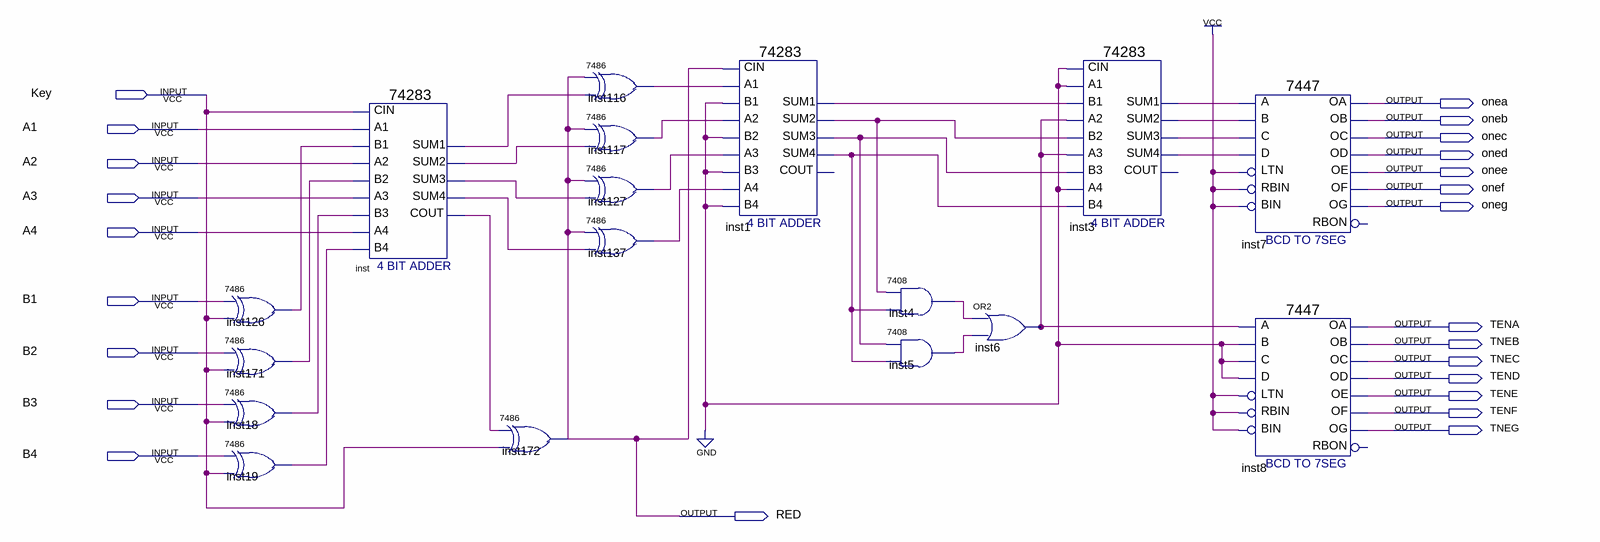
[diagram p0: schematic sheet]
// Quartus schematic Block1.bdf as structural Verilog: 17 symbols, 24 pins
module Block1 (
  input  Key,
  input  A1,
  input  A2,
  input  A3,
  input  A4,
  input  B1,
  input  B2,
  input  B3,
  input  B4,
  output onea,
  output oneb,
  output onec,
  output oned,
  output onee,
  output onef,
  output oneg,
  output TENA,
  output TNEB,
  output TNEC,
  output TEND,
  output TENE,
  output TENF,
  output TNEG,
  output RED
);

  wire inst1_sum1, inst1_sum2, inst1_sum3, inst1_sum4, inst3_sum1, inst3_sum2, inst3_sum3, inst3_sum4,
       inst4_1, inst5_1, inst6_out, inst18_1, inst19_1, inst116_1, inst117_1, inst126_1, inst127_1,
       inst137_1, inst171_1, inst_cout, inst_sum1, inst_sum2, inst_sum3, inst_sum4;

  \7486  inst126 (.\2 (B1), .\3 (Key), .\1 (inst126_1));
  \7486  inst171 (.\2 (B2), .\3 (Key), .\1 (inst171_1));
  \7486  inst18 (.\2 (B3), .\3 (Key), .\1 (inst18_1));
  \7486  inst19 (.\2 (B4), .\3 (Key), .\1 (inst19_1));
  \74283  inst (
    .CIN(Key), .A1(A1), .A2(A2), .B2(inst171_1), .A3(A3), .A4(A4), .B4(inst19_1), .B1(inst126_1),
    .B3(inst18_1), .SUM4(inst_sum4), .COUT(inst_cout), .SUM1(inst_sum1), .SUM2(inst_sum2), .SUM3(inst_sum3));
  \7486  inst172 (.\2 (inst_cout), .\3 (Key), .\1 (RED));
  \7486  inst116 (.\2 (RED), .\3 (inst_sum1), .\1 (inst116_1));
  \7486  inst117 (.\2 (RED), .\3 (inst_sum2), .\1 (inst117_1));
  \7486  inst127 (.\2 (RED), .\3 (inst_sum3), .\1 (inst127_1));
  \7486  inst137 (.\2 (RED), .\3 (inst_sum4), .\1 (inst137_1));
  \74283  inst1 (
    .CIN(RED), .A1(inst116_1), .A2(inst117_1), .B2(1'b0), .A3(inst127_1), .A4(inst137_1), .B4(1'b0),
    .B1(1'b0), .B3(1'b0), .SUM4(inst1_sum4), .SUM1(inst1_sum1), .SUM2(inst1_sum2), .SUM3(inst1_sum3));  // open: COUT
  \7408  inst4 (.\3 (inst1_sum4), .\2 (inst1_sum2), .\1 (inst4_1));
  \7408  inst5 (.\3 (inst1_sum4), .\2 (inst1_sum3), .\1 (inst5_1));
  or inst6 (inst6_out, inst4_1, inst5_1);
  \74283  inst3 (
    .CIN(1'b0), .A1(1'b0), .A2(inst6_out), .B2(inst1_sum2), .A3(inst6_out), .A4(1'b0), .B4(inst1_sum4),
    .B1(inst1_sum1), .B3(inst1_sum3), .SUM4(inst3_sum4), .SUM1(inst3_sum1), .SUM2(inst3_sum2),
    .SUM3(inst3_sum3));  // open: COUT
  \7447  inst7 (
    .LTN(1'b1), .B(inst3_sum2), .C(inst3_sum3), .D(inst3_sum4), .RBIN(1'b1), .BIN(1'b1), .A(inst3_sum1),
    .OB(oneb), .OC(onec), .OE(onee), .OD(oned), .OF(onef), .OG(oneg), .OA(onea));  // open: RBON
  \7447  inst8 (
    .LTN(1'b1), .B(1'b0), .C(1'b0), .D(1'b0), .RBIN(1'b1), .BIN(1'b1), .A(inst6_out), .OB(TNEB), .OC(TNEC),
    .OE(TENE), .OD(TEND), .OF(TENF), .OG(TNEG), .OA(TENA));  // open: RBON
endmodule
